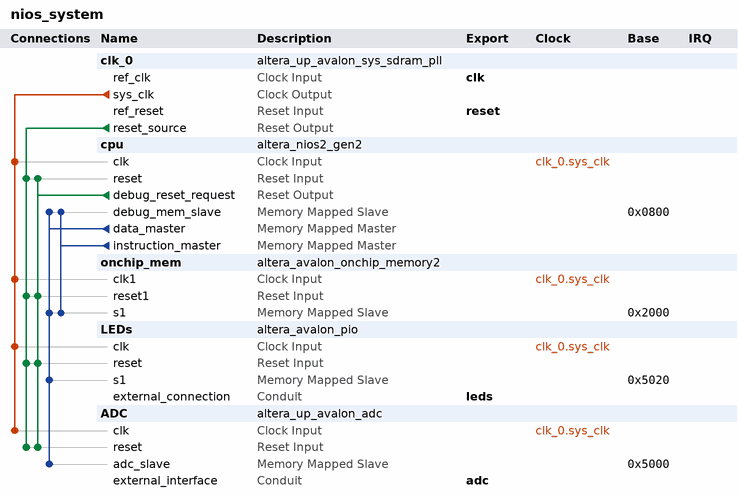
[diagram p0: system contents]
# Platform Designer (Qsys) system nios_system, Cyclone V 5CSEBA6U23I7
# Parameters at their usual value, and those the tool derives, are not listed.
package require -exact qsys 21.1
create_system nios_system
set_project_property DEVICE_FAMILY {Cyclone V}
set_project_property DEVICE 5CSEBA6U23I7

add_instance clk_0 altera_up_avalon_sys_sdram_pll 18.0
set_instance_parameter_value clk_0 CV_boards DE10-Nano
set_instance_parameter_value clk_0 gui_outclk 100.0
set_instance_parameter_value clk_0 gui_refclk 50.0

add_instance cpu altera_nios2_gen2 21.1
set_instance_parameter_value cpu dcache_size 2048
set_instance_parameter_value cpu exceptionSlave onchip_mem.s1
set_instance_parameter_value cpu icache_size 4096
set_instance_parameter_value cpu impl Tiny
set_instance_parameter_value cpu resetSlave onchip_mem.s1

add_instance onchip_mem altera_avalon_onchip_memory2 21.1
set_instance_parameter_value onchip_mem dataWidth 32
set_instance_parameter_value onchip_mem dualPort false
set_instance_parameter_value onchip_mem initMemContent true
set_instance_parameter_value onchip_mem initializationFileName onchip_mem.hex
set_instance_parameter_value onchip_mem memorySize 8192

add_instance LEDs altera_avalon_pio 21.1
set_instance_parameter_value LEDs direction Output
set_instance_parameter_value LEDs width 8

add_instance ADC altera_up_avalon_adc 18.0
set_instance_parameter_value ADC board DE10-Nano
set_instance_parameter_value ADC numch_ 8

# connections
add_connection clk_0.sys_clk ADC.clk clock
add_connection clk_0.sys_clk cpu.clk clock
add_connection clk_0.sys_clk LEDs.clk clock
add_connection clk_0.sys_clk onchip_mem.clk1 clock
add_connection clk_0.reset_source ADC.reset reset
add_connection clk_0.reset_source cpu.reset reset
add_connection clk_0.reset_source LEDs.reset reset
add_connection clk_0.reset_source onchip_mem.reset1 reset
add_connection cpu.debug_reset_request ADC.reset reset
add_connection cpu.debug_reset_request cpu.reset reset
add_connection cpu.debug_reset_request LEDs.reset reset
add_connection cpu.debug_reset_request onchip_mem.reset1 reset
add_connection cpu.data_master ADC.adc_slave avalon
set_connection_parameter_value cpu.data_master/ADC.adc_slave baseAddress 0x5000
add_connection cpu.data_master cpu.debug_mem_slave avalon
set_connection_parameter_value cpu.data_master/cpu.debug_mem_slave baseAddress 0x0800
add_connection cpu.data_master LEDs.s1 avalon
set_connection_parameter_value cpu.data_master/LEDs.s1 baseAddress 0x5020
add_connection cpu.data_master onchip_mem.s1 avalon
set_connection_parameter_value cpu.data_master/onchip_mem.s1 baseAddress 0x2000
add_connection cpu.instruction_master cpu.debug_mem_slave avalon
set_connection_parameter_value cpu.instruction_master/cpu.debug_mem_slave baseAddress 0x0800
add_connection cpu.instruction_master onchip_mem.s1 avalon
set_connection_parameter_value cpu.instruction_master/onchip_mem.s1 baseAddress 0x2000

# exported interfaces
add_interface adc conduit end
set_interface_property adc EXPORT_OF ADC.external_interface
add_interface clk clock sink
set_interface_property clk EXPORT_OF clk_0.ref_clk
add_interface leds conduit end
set_interface_property leds EXPORT_OF LEDs.external_connection
add_interface reset reset sink
set_interface_property reset EXPORT_OF clk_0.ref_reset

set_interconnect_requirement {$system} qsys_mm.clockCrossingAdapter HANDSHAKE
set_interconnect_requirement {$system} qsys_mm.enableEccProtection FALSE
set_interconnect_requirement {$system} qsys_mm.insertDefaultSlave FALSE
set_interconnect_requirement {$system} qsys_mm.maxAdditionalLatency 1

save_system nios_system.qsys
